# Altium schematic sheet STM32_USB-C.SchDoc
size A; SheetNumber: 1; SheetTotal: 4
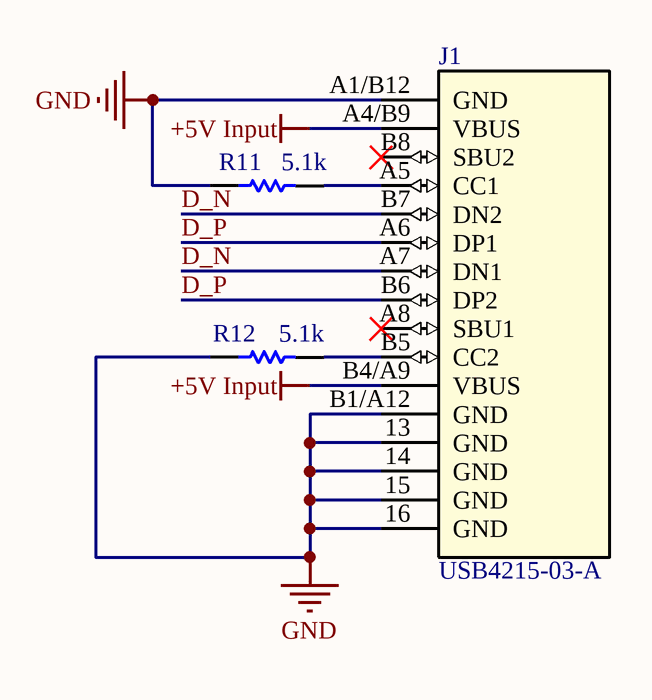
[diagram p0: STM32_USB-C.SchDoc]

## Parts
J1  USB4215-03-A  [CONN_8p94X6p5X3p16_12L_GCC]
R11  Resistance: 5.1k  [RESC1608X55X25LL10T15]  (hidden comment: RC0603JR-075K1L)
R12  Resistance: 5.1k  [RESC1608X55X25LL10T15]  (hidden comment: RC0603JR-075K1L)

## Nets
+5V Input: J1.A4/B9(VBUS) J1.B4/A9(VBUS)
GND: J1.13(GND) J1.14(GND) J1.15(GND) J1.16(GND) J1.A1/B12(GND) J1.B1/A12(GND) R11.1 R12.1
D_N: J1.A7(DN1) J1.B7(DN2)
D_P: J1.A6(DP1) J1.B6(DP2)
NetJ1_A5: J1.A5(CC1) R11.2
NetJ1_B5: J1.B5(CC2) R12.2

Not connected (* = marked no-connect by the designer): J1 A8(SBU1)* B8(SBU2)*

## Library data of the parts
J1 = USB4215-03-A: Description; Manufacturer_Name: Global Connector Technology; Copyright: Copyright (C) 2025 Ultra Librarian. All rights reserved.; Manufacturer_Part_Number: USB4215-03-A; RefDes: RefDes; Type: Type
R11 R12 = CMP-1012-00091-2: Chip Resistor, 5.1 KOhm, +/- 5%, 0.1 W, -55 to 155 degC, 0603 (1608 Metric), RoHS, Tape and Reel; Manufacturer: Yageo; Voltage Rating: 50V; Temperature Coefficient: 100PPM/C; Power Rating: 100mW; Mounting Technology: SurfaceMount; Case Code - in: 0603; Product: ThickFilmResistorsGeneralPurpose; Series: RC; Packaging: Reel; Tolerance: 5%; Operating Temperature Range: -55Cto+155C; Package Description: 2-Pin Surface Mount Device, Body 1.6 x 0.8 mm; Manufacturer URL: http://www.yageo.com/; Datasheet Version: Rev. 7, 05/2017; Termination Style: SMD/SMT; Package Reference: 0603; Datasheet URL: http://www.yageo.com/documents/recent/PYu-RC_Group_51_RoHS_L_7.pdf; Case Code - mm: 1608